# Altium schematic sheet 15-12power.SchDoc
size A4
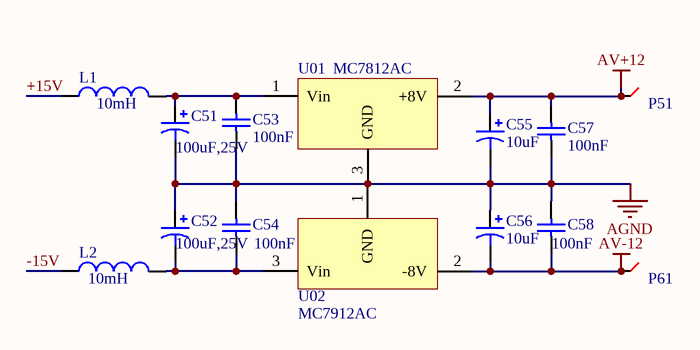
[diagram p0: 15-12power.SchDoc]

## Parts
C51  value 100uF,25V  [CAPC2012L]  (hidden comment: Cap Pol3)
C52  value 100uF,25V  [CAPC2012L]  (hidden comment: Cap Pol3)
C53  value 100nF  [0805-2]  (hidden comment: Cap)
C54  value 100nF  [0805-2]  (hidden comment: Cap)
C55  value 10uF  [RB7.6-15]  (hidden comment: Cap Pol1)
C56  value 10uF  [RB7.6-15]  (hidden comment: Cap Pol1)
C57  value 100nF  [0805-2]  (hidden comment: Cap)
C58  value 100nF  [0805-2]  (hidden comment: Cap)
L1  value 10mH  [INDC1005AL]  (hidden comment: Inductor)
L2  value 10mH  [INDC1005AL]  (hidden comment: Inductor)
P51  测试点  [Text_PAD]  (value not drawn)
P61  测试点  [Text_PAD]  (value not drawn)
U01  MC7812AC  [7812]
U02  MC7912AC  [7912]

## Nets
AGND: C51.2 C52.1 C53.1 C54.2 C55.2 C56.1 C57.1 C58.2 U01.3(GND) U02.1(GND)
AV+12: C55.1 C57.2 P51.A5 U01.2(+8V)
AV-12: C56.2 C58.1 P61.A5 U02.2(-8V)
+15V: L1.1
-15V: L2.1
NetC51_1: C51.1 C53.2 L1.2 U01.1(Vin)
NetC52_2: C52.2 C54.1 L2.2 U02.3(Vin)

## Library data of the parts
C51 C52 = Cap Pol3: Polarized Capacitor (Surface Mount); Published: 8-Jun-2000; LatestRevisionDate: 29-May-2009; LatestRevisionNote: IPC-7351 Footprint Added.; PackageReference: C0805; Publisher: Altium Limited; PackageDescription: Chip Capacitor
C53 C54 C57 C58 = Cap: Capacitor; Published: 8-Jun-2000; LatestRevisionDate: 17-Jul-2002; LatestRevisionNote: Re-released for DXP Platform.; PackageReference: RAD-0.3; Publisher: Altium Limited
C55 C56 = Cap Pol1: Polarized Capacitor (Radial); Published: 8-Jun-2000; LatestRevisionDate: 17-Jul-2002; LatestRevisionNote: Re-released for DXP Platform.; PackageReference: RB7.6-15; Publisher: Altium Limited
L1 L2 = Inductor: Code_IEC: 1005; Published: 8-Jun-2000; LatestRevisionDate: 29-May-2009; LatestRevisionNote: IPC-7351 Footprint Added.; PackageReference: 0402-A; Publisher: Altium Limited; PackageDescription: Chip Inductor; Code_JEITA: 0402
U01 = MC7808K
U02 = MC7908K